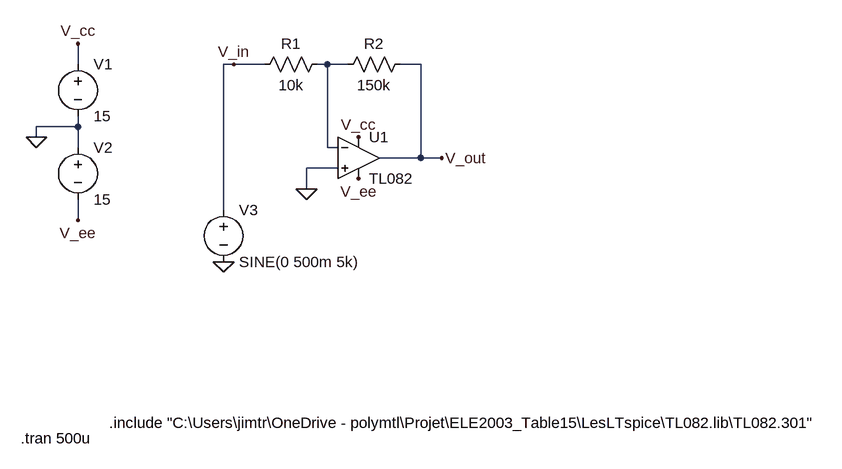
[diagram p0: schematic inverseur.asc]
inverseur.asc, the LTspice schematic file:
Version 4.1
SHEET 1 1476 720
WIRE 96 112 96 80
WIRE 336 112 320 112
WIRE 384 112 336 112
WIRE 480 112 464 112
WIRE 512 112 480 112
WIRE 624 112 592 112
WIRE 96 208 96 192
WIRE 96 208 32 208
WIRE 32 224 32 208
WIRE 96 240 96 208
WIRE 480 240 480 112
WIRE 496 240 480 240
WIRE 624 256 624 112
WIRE 624 256 560 256
WIRE 656 256 624 256
WIRE 496 272 448 272
WIRE 448 304 448 272
WIRE 320 336 320 112
WIRE 96 352 96 320
FLAG 32 224 0
FLAG 96 80 V_cc
FLAG 96 352 V_ee
FLAG 528 224 V_cc
FLAG 528 288 V_ee
FLAG 336 112 V_in
FLAG 656 256 V_out
FLAG 448 304 0
FLAG 320 416 0
SYMBOL voltage 96 96 R0
WINDOW 123 0 0 Left 0
WINDOW 39 0 0 Left 0
SYMATTR InstName V1
SYMATTR Value 15
SYMBOL voltage 96 224 R0
WINDOW 123 0 0 Left 0
WINDOW 39 0 0 Left 0
SYMATTR InstName V2
SYMATTR Value 15
SYMBOL res 480 96 R90
WINDOW 0 0 56 VBottom 2
WINDOW 3 32 56 VTop 2
SYMATTR InstName R1
SYMATTR Value 10k
SYMBOL res 608 96 R90
WINDOW 0 0 56 VBottom 2
WINDOW 3 32 56 VTop 2
SYMATTR InstName R2
SYMATTR Value 150k
SYMBOL OpAmps\\opamp2 528 192 R0
SYMATTR InstName U1
SYMATTR Value TL082
SYMBOL voltage 320 320 R0
WINDOW 123 0 0 Left 0
WINDOW 39 0 0 Left 0
SYMATTR InstName V3
SYMATTR Value SINE(0 500m 5k)
TEXT 144 664 Left 2 !.include "C:\\Users\\jimtr\\OneDrive - polymtl\\Projet\\ELE2003_Table15\\LesLTspice\\TL082.lib\\TL082.301"
TEXT 8 688 Left 2 !.tran 500u

The netlist it stands for:
* inverseur.asc
V1 V_cc 0 15
V2 0 V_ee 15
R1 N001 V_in 10k
R2 V_out N001 150k
X§U1 0 N001 V_cc V_ee V_out TL082  ; pins In+ In- V+ V- OUT
V3 V_in 0 SINE(0 500m 5k)
.include "C:\Users\jimtr\OneDrive - polymtl\Projet\ELE2003_Table15\LesLTspice\TL082.lib\TL082.301"
.tran 500u
.backanno
.end